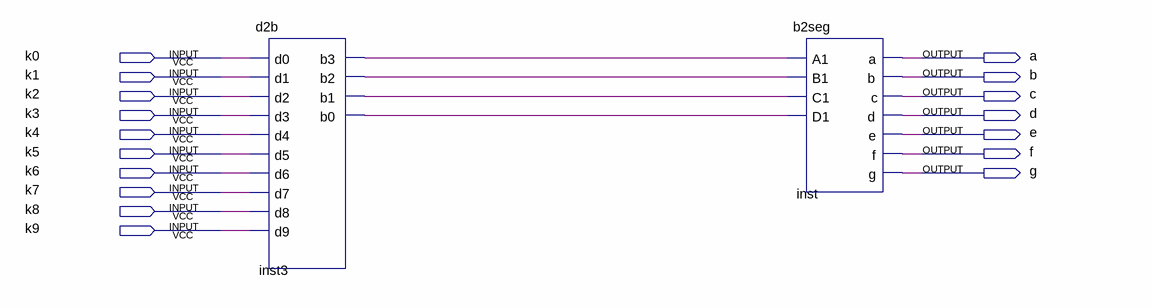
[diagram p0: schematic sheet]
// Quartus schematic ex1.bdf as structural Verilog: 2 symbols, 17 pins
module ex1 (
  input  k0,
  input  k1,
  input  k2,
  input  k3,
  input  k4,
  input  k5,
  input  k6,
  input  k7,
  input  k8,
  input  k9,
  output a,
  output b,
  output c,
  output d,
  output e,
  output f,
  output g
);

  wire inst3_b0, inst3_b1, inst3_b2, inst3_b3;

  d2b inst3 (
    .d0(k0), .d1(k1), .d2(k2), .d3(k3), .d4(k4), .d5(k5), .d6(k6), .d7(k7), .d8(k8), .d9(k9), .b3(inst3_b3),
    .b2(inst3_b2), .b1(inst3_b1), .b0(inst3_b0));
  b2seg inst (
    .A1(inst3_b3), .B1(inst3_b2), .C1(inst3_b1), .D1(inst3_b0), .a(a), .b(b), .c(c), .d(d), .e(e), .f(f),
    .g(g));
endmodule
